# Altium schematic sheet 19-CPLD.SchDoc
size A4; DocumentNumber: 18; SheetNumber: 19; SheetTotal: 26
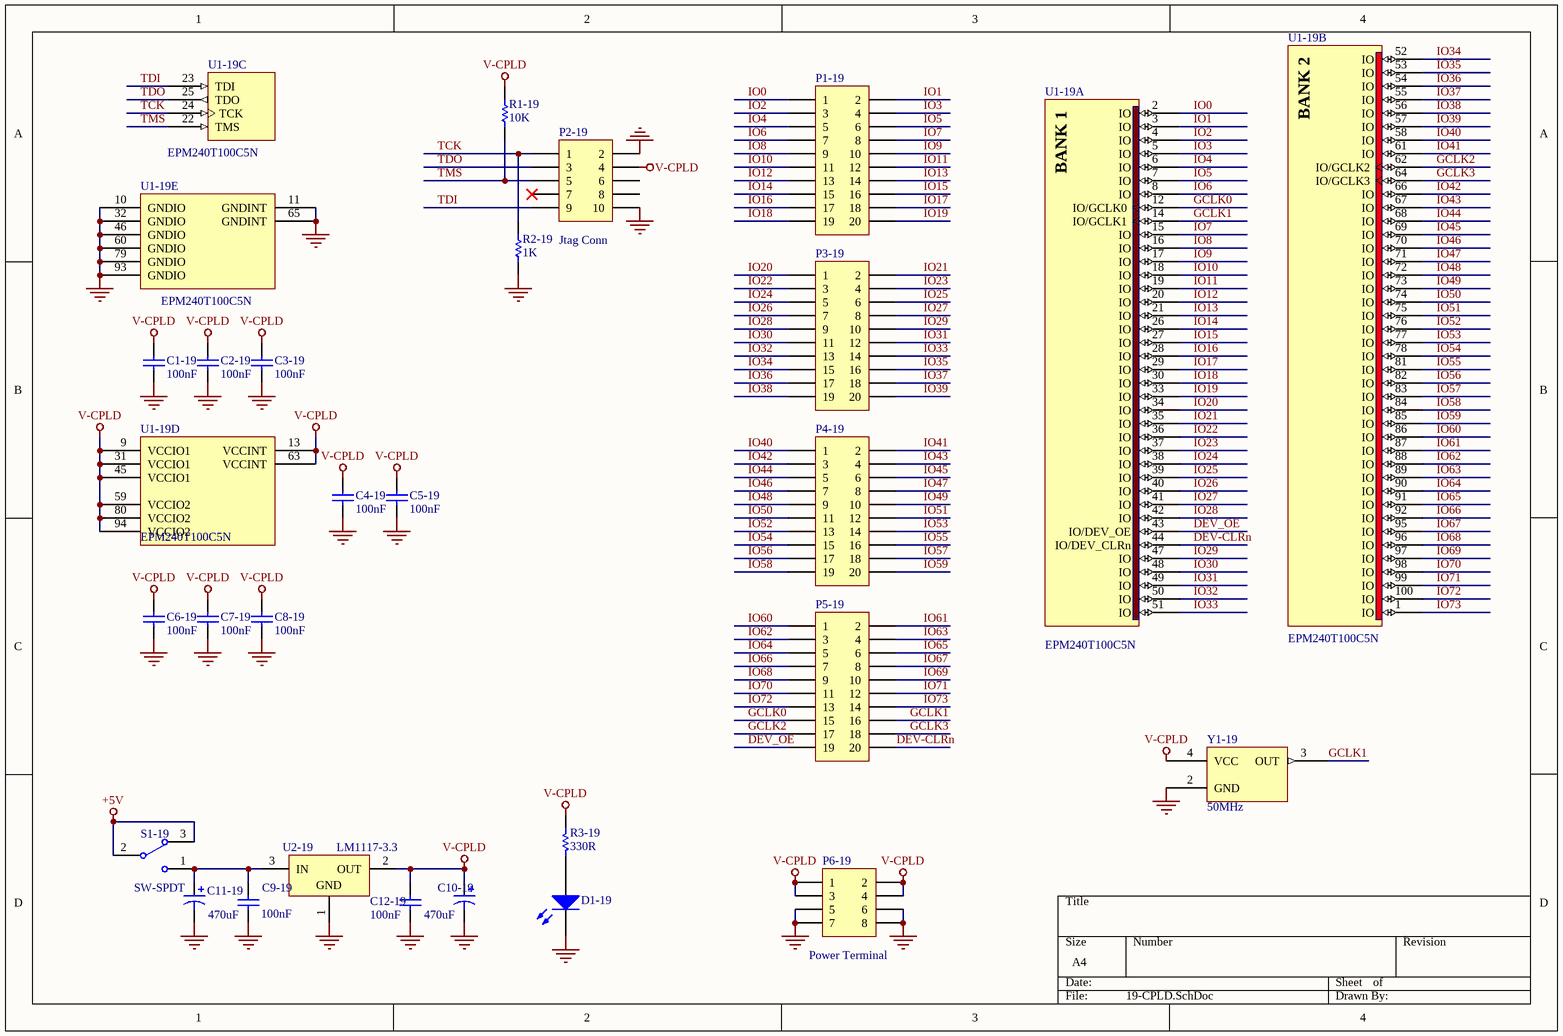
[diagram p0: 19-CPLD.SchDoc]

## Parts
C1-19  value 100nF  [c-0805]  (hidden comment: 104)
C2-19  value 100nF  [c-0805]  (hidden comment: 104)
C3-19  value 100nF  [c-0805]  (hidden comment: 104)
C4-19  value 100nF  [c-0805]  (hidden comment: 104)
C5-19  value 100nF  [c-0805]  (hidden comment: 104)
C6-19  value 100nF  [c-0805]  (hidden comment: 104)
C7-19  value 100nF  [c-0805]  (hidden comment: 104)
C8-19  value 100nF  [c-0805]  (hidden comment: 104)
C9-19  value 100nF  [c-0805]  (hidden comment: 104)
C10-19  value 470uF  [C-ALU-10x10mm]  (hidden comment: 470uF/16V)
C11-19  value 470uF  [C-ALU-10x10mm]  (hidden comment: 470uF/16V)
C12-19  value 100nF  [c-0805]  (hidden comment: 104)
D1-19  LED  [LED-0805]  (value not drawn)
P1-19  H2  [HDR2X10]  (value not drawn)
P2-19  value Jtag Conn  [CONN-IDC-5X2-A]  (hidden comment: IDE5x2)
P3-19  H2  [HDR2X10]  (value not drawn)
P4-19  H2  [HDR2X10]  (value not drawn)
P5-19  H2  [HDR2X10]  (value not drawn)
P6-19  Publisher: Power Terminal  [JP2.54-F-2x04A]  (hidden comment: Header 4X2)
R1-19  10K  [R-0805]
R2-19  1K  [R-0805]
R3-19  value 330R  [R-0805]  (hidden comment: 331)
S1-19  SW-SPDT  [SW-SLIDE-2P-2W]
U1-19  EPM240T100C5N  [TQFP-100]  (parts A,B,C,D,E of 5)
U2-19  LM1117-3.3  [SOT-223-3]
Y1-19  50MHz  [XTAL-SMD5070]

## Nets
+5V: S1-19.2 S1-19.3
GND: C1-19.2 C2-19.2 C3-19.2 C4-19.2 C5-19.2 C6-19.2 C7-19.2 C8-19.2 C9-19.1 C10-19.2 C11-19.2 C12-19.1 D1-19.2(K) P2-19.2 P2-19.10 P6-19.5 P6-19.6 P6-19.7 P6-19.8 R2-19.2 U1-19.10(GNDIO) U1-19.11(GNDINT) U1-19.32(GNDIO) U1-19.46(GNDIO) U1-19.60(GNDIO) U1-19.65(GNDINT) U1-19.79(GNDIO) U1-19.93(GNDIO) U2-19.1(GND) Y1-19.2(GND)
V-CPLD: C1-19.1 C2-19.1 C3-19.1 C4-19.1 C5-19.1 C6-19.1 C7-19.1 C8-19.1 C10-19.1 C12-19.2 P2-19.4 P6-19.1 P6-19.2 P6-19.3 P6-19.4 R1-19.1 R3-19.1 U1-19.9(VCCIO1) U1-19.13(VCCINT) U1-19.31(VCCIO1) U1-19.45(VCCIO1) U1-19.59(VCCIO2) U1-19.63(VCCINT) U1-19.80(VCCIO2) U1-19.94(VCCIO2) U2-19.2(OUT) Y1-19.4(VCC)
DEV-CLRn: P5-19.20 U1-19.44(IO/DEV_CLRn)
DEV_OE: P5-19.19 U1-19.43(IO/DEV_OE)
GCLK0: P5-19.15 U1-19.12(IO/GCLK0)
GCLK1: P5-19.16 U1-19.14(IO/GCLK1) Y1-19.3(OUT)
GCLK2: P5-19.17 U1-19.62(IO/GCLK2)
GCLK3: P5-19.18 U1-19.64(IO/GCLK3)
IO0: P1-19.1 U1-19.2(IO)
IO1: P1-19.2 U1-19.3(IO)
IO2: P1-19.3 U1-19.4(IO)
IO3: P1-19.4 U1-19.5(IO)
IO4: P1-19.5 U1-19.6(IO)
IO5: P1-19.6 U1-19.7(IO)
IO6: P1-19.7 U1-19.8(IO)
IO7: P1-19.8 U1-19.15(IO)
IO8: P1-19.9 U1-19.16(IO)
IO9: P1-19.10 U1-19.17(IO)
IO10: P1-19.11 U1-19.18(IO)
IO11: P1-19.12 U1-19.19(IO)
IO12: P1-19.13 U1-19.20(IO)
IO13: P1-19.14 U1-19.21(IO)
IO14: P1-19.15 U1-19.26(IO)
IO15: P1-19.16 U1-19.27(IO)
IO16: P1-19.17 U1-19.28(IO)
IO17: P1-19.18 U1-19.29(IO)
IO18: P1-19.19 U1-19.30(IO)
IO19: P1-19.20 U1-19.33(IO)
IO20: P3-19.1 U1-19.34(IO)
IO21: P3-19.2 U1-19.35(IO)
IO22: P3-19.3 U1-19.36(IO)
IO23: P3-19.4 U1-19.37(IO)
IO24: P3-19.5 U1-19.38(IO)
IO25: P3-19.6 U1-19.39(IO)
IO26: P3-19.7 U1-19.40(IO)
IO27: P3-19.8 U1-19.41(IO)
IO28: P3-19.9 U1-19.42(IO)
IO29: P3-19.10 U1-19.47(IO)
IO30: P3-19.11 U1-19.48(IO)
IO31: P3-19.12 U1-19.49(IO)
IO32: P3-19.13 U1-19.50(IO)
IO33: P3-19.14 U1-19.51(IO)
IO34: P3-19.15 U1-19.52(IO)
IO35: P3-19.16 U1-19.53(IO)
IO36: P3-19.17 U1-19.54(IO)
IO37: P3-19.18 U1-19.55(IO)
IO38: P3-19.19 U1-19.56(IO)
IO39: P3-19.20 U1-19.57(IO)
IO40: P4-19.1 U1-19.58(IO)
IO41: P4-19.2 U1-19.61(IO)
IO42: P4-19.3 U1-19.66(IO)
IO43: P4-19.4 U1-19.67(IO)
IO44: P4-19.5 U1-19.68(IO)
IO45: P4-19.6 U1-19.69(IO)
IO46: P4-19.7 U1-19.70(IO)
IO47: P4-19.8 U1-19.71(IO)
IO48: P4-19.9 U1-19.72(IO)
IO49: P4-19.10 U1-19.73(IO)
IO50: P4-19.11 U1-19.74(IO)
IO51: P4-19.12 U1-19.75(IO)
IO52: P4-19.13 U1-19.76(IO)
IO53: P4-19.14 U1-19.77(IO)
IO54: P4-19.15 U1-19.78(IO)
IO55: P4-19.16 U1-19.81(IO)
IO56: P4-19.17 U1-19.82(IO)
IO57: P4-19.18 U1-19.83(IO)
IO58: P4-19.19 U1-19.84(IO)
IO59: P4-19.20 U1-19.85(IO)
IO60: P5-19.1 U1-19.86(IO)
IO61: P5-19.2 U1-19.87(IO)
IO62: P5-19.3 U1-19.88(IO)
IO63: P5-19.4 U1-19.89(IO)
IO64: P5-19.5 U1-19.90(IO)
IO65: P5-19.6 U1-19.91(IO)
IO66: P5-19.7 U1-19.92(IO)
IO67: P5-19.8 U1-19.95(IO)
IO68: P5-19.9 U1-19.96(IO)
IO69: P5-19.10 U1-19.97(IO)
IO70: P5-19.11 U1-19.98(IO)
IO71: P5-19.12 U1-19.99(IO)
IO72: P5-19.13 U1-19.100(IO)
IO73: P5-19.14 U1-19.1(IO)
TCK: P2-19.1 R2-19.1 U1-19.24(TCK)
TDI: P2-19.9 U1-19.23(TDI)
TDO: P2-19.3 U1-19.25(TDO)
TMS: P2-19.5 R1-19.2 U1-19.22(TMS)
NetC9-19_2: C9-19.2 C11-19.1 S1-19.1 U2-19.3(IN)
NetD1-19_1: D1-19.1(A) R3-19.2

Not connected (* = marked no-connect by the designer): P2-19 6 7* 8; Y1-19 1(NC)

## Notes on the sheet
- (in symbol EPM240T100C5N, part A) BANK 1
- (in symbol EPM240T100C5N, part B) BANK 2

## Library data of the parts
C1-19 C2-19 C3-19 C4-19 C5-19 C6-19 C7-19 C8-19 = Cap: Capacitor; Published: 8-Jun-2000; LatestRevisionDate: 17-Jul-2002; LatestRevisionNote: Re-released for DXP Platform.; PackageReference: RAD-0.3; Publisher: Altium Limited; PackageDescription: Radial Cap, Thru-Hole; 2 Leads; 0.3 in Pin Spacing
C9-19 C12-19 = Cap: Capacitor; Manufacturer: Generic Components; Class: Passive; Published: 08/06/2000; Publisher: Altium Hobart Technology Centre; SubClass: Capacitor
C10-19 C11-19 = Cap Pol1: Polarized Capacitor (Radial); Published: 8-Jun-2000; LatestRevisionDate: 17-Jul-2002; LatestRevisionNote: Re-released for DXP Platform.; PackageReference: RB7.6-15; Publisher: Altium Limited
D1-19 = LED0: Typical INFRARED GaAs LED; Published: 8-Jun-2000; LatestRevisionDate: 08-Jul-2005; LatestRevisionNote: Mech Layer 1 removed.; PackageReference: LED-0; Publisher: Altium Limited; Value: LED
P1-19 P3-19 P4-19 P5-19 = Header 10X2: Header, 10-Pin, Dual row; Value: IO; LatestRevisionDate: 17-Jul-2002; LatestRevisionNote: Re-released for DXP Platform.
P2-19 = Header 5X2: Header, 5-Pin, Dual row; LatestRevisionDate: 17-Jul-2002; LatestRevisionNote: Re-released for DXP Platform.
P6-19 = Header 4X2: Header, 4-Pin, Dual row; LatestRevisionDate: 17-Jul-2002; LatestRevisionNote: Re-released for DXP Platform.
R1-19 R2-19 R3-19 = Res1: Resistor; Published: 8-Jun-2000; LatestRevisionDate: 17-Jul-2002; LatestRevisionNote: Re-released for DXP Platform.; PackageReference: AXIAL-0.3; Publisher: Altium Limited
  R1-19: Value: 10K
  R2-19: Value: 1K
S1-19 = SW-SPDT: SPDT Subminiature Toggle Switch, Right Angle Mounting, Vertical Actuation; Published: 24-Mar-1999; LatestRevisionDate: 17-Dec-2003; LatestRevisionNote: Schematic revised, PCB Footprint replaced.; DatasheetVersion: 05-Dec-2000; PackageReference: TL36WW15050; Publisher: Altium Limited; PackageDescription: Switch; 4 Leads; ComponentLink1Description: Manufacturer Link; ComponentLink1URL: http://www.apem.com
U1-19 = EPM240T100C5N: MAX II 3.3/2.5V CPLD, 80 IOs, 240 Logic Elements, 100-Pin Plastic TQFP, Commercial Temperature, Speed Grade 5, Pb-Free; Note: Each set of VCCIO pins can be connected to 3.3V, 2.5V, 1.8V, or 1.5V.; Note: All VCCINT pins must be connected to either 3.3V or 2.5V (but not a combination of both).; Published: 4-Mar-2005; LatestRevisionDate: 13-Apr-2006; LatestRevisionNote: IPC-7351 Footprint Added.; DatasheetVersion: ver1.8, Jul-2006; PackageVersion: ver15.1, May-2008; PackageReference: TQFP100; Publisher: Altium Limited; PackageDescription: 100-Pin Plastic Thin Quad Flat Pack (TQFP100) - Wire Bond; Supplier 1: Digi-Key; Supplier Part Number 1: 544-1964-ND; Supplier 2: Farnell; Supplier Part Number 2: 1662268; Supplier 3: Farnell; Supplier Part Number 3: 1453503; Code_JEDEC: MS-026-AED; ComponentLink1Description: Manufacturer Link; ComponentLink1URL: http://www.altera.com/products/devices/cpld/max2/mx2-index.jsp; ComponentLink2Description: Handbook; ComponentLink2URL: http://www.altera.com/literature/hb/max2/max2_mii5v1.pdf; ComponentLink3Description: Packaging Specification; ComponentLink3URL: http://www.altera.com/literature/ds/dspkg.pdf
U2-19 = LM1117IDTX-3.3: 800mA Low-Dropout Linear Regulator, 3-pin TO-252; Manufacturer: National Semiconductor; PackageTopMarking: NSUZXYTT*LM1117*IDT-3.3; PowerWise: N; CompType: LDO IC; Published: 1-Mar-2010; DatasheetVersion: Apr-2006; PackageVersion: revD, Feb-2009; PackageReference: TD03B; Publisher: Altium Limited; PackageDescription: TO252, Molded, Jedec, 6.8 x 6.10 x 2.30mm Body, 3 Lead, 2.28mm Pitch, Surface Mount; PartNumber: LM1117IDTX-3.3; Value: LM1117-3.3; PinCount: 3; Code_JEDEC: TO-252-AA; ComponentLink1Description: LM1117 Datasheet; ComponentLink1URL: http://www.national.com/ds/LM/LM1117.pdf; ComponentLink2Description: LM1117 Web Page; ComponentLink2URL: http://www.national.com/pf/LM/LM1117.html; ComponentLink3Description: TD03B Package Page; ComponentLink3URL: http://www.national.com/packaging/folders/td03b.html
Y1-19 = OSC: XTAL 50MHz, 4pin; Value: 50MHz